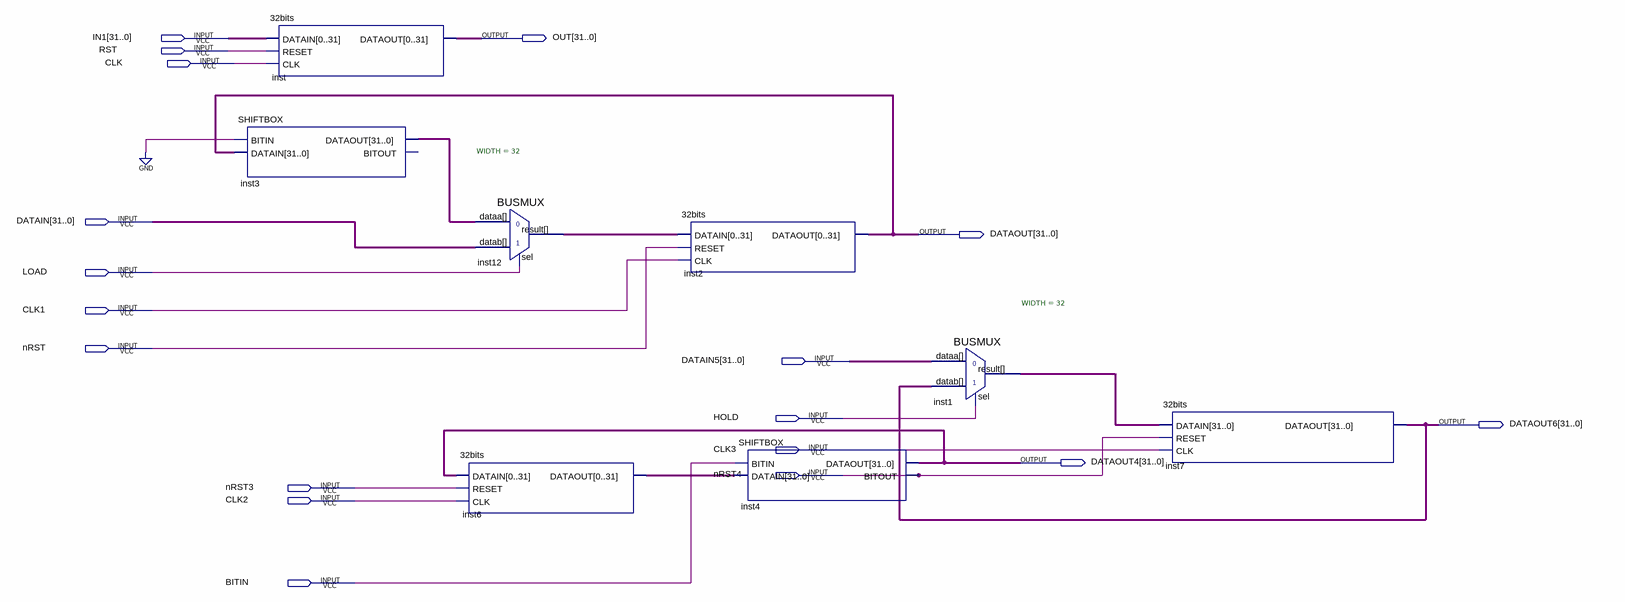
[diagram p0: schematic sheet]
// Quartus schematic TEST5.bdf as structural Verilog: 8 symbols, 18 pins
module TEST5 (
  input  [31:0] IN1,
  input  RST,
  input  CLK,
  input  [31:0] DATAIN,
  input  LOAD,
  input  CLK1,
  input  nRST,
  input  [31:0] DATAIN5,
  input  HOLD,
  input  CLK3,
  input  nRST4,
  input  nRST3,
  input  CLK2,
  input  BITIN,
  output [31:0] OUT,
  output [31:0] DATAOUT,
  output [31:0] DATAOUT6,
  output [31:0] DATAOUT4
);

  wire [31:0] inst1_result, inst3_dataout, inst6_dataout, inst12_result;

  SHIFTBOX inst3 (.BITIN(1'b0), .DATAIN(DATAOUT), .DATAOUT(inst3_dataout));  // open: BITOUT
  \32bits  inst (.DATAIN(IN1), .RESET(RST), .CLK(CLK), .DATAOUT(OUT));
  BUSMUX #(.WIDTH(32)) inst12 (.datab(DATAIN), .sel(LOAD), .dataa(inst3_dataout), .result(inst12_result));
  \32bits  inst6 (.DATAIN(DATAOUT4), .RESET(nRST3), .CLK(CLK2), .DATAOUT(inst6_dataout));
  \32bits  inst2 (.DATAIN(inst12_result), .RESET(nRST), .CLK(CLK1), .DATAOUT(DATAOUT));
  SHIFTBOX inst4 (.BITIN(BITIN), .DATAIN(inst6_dataout), .DATAOUT(DATAOUT4), .BITOUT(nRST4));
  BUSMUX #(.WIDTH(32)) inst1 (.datab(DATAOUT6), .sel(HOLD), .dataa(DATAIN5), .result(inst1_result));
  \32bits  inst7 (.DATAIN(inst1_result), .RESET(nRST4), .CLK(CLK3), .DATAOUT(DATAOUT6));
endmodule
